# EAGLE design platine (EAGLE 6.5.0)
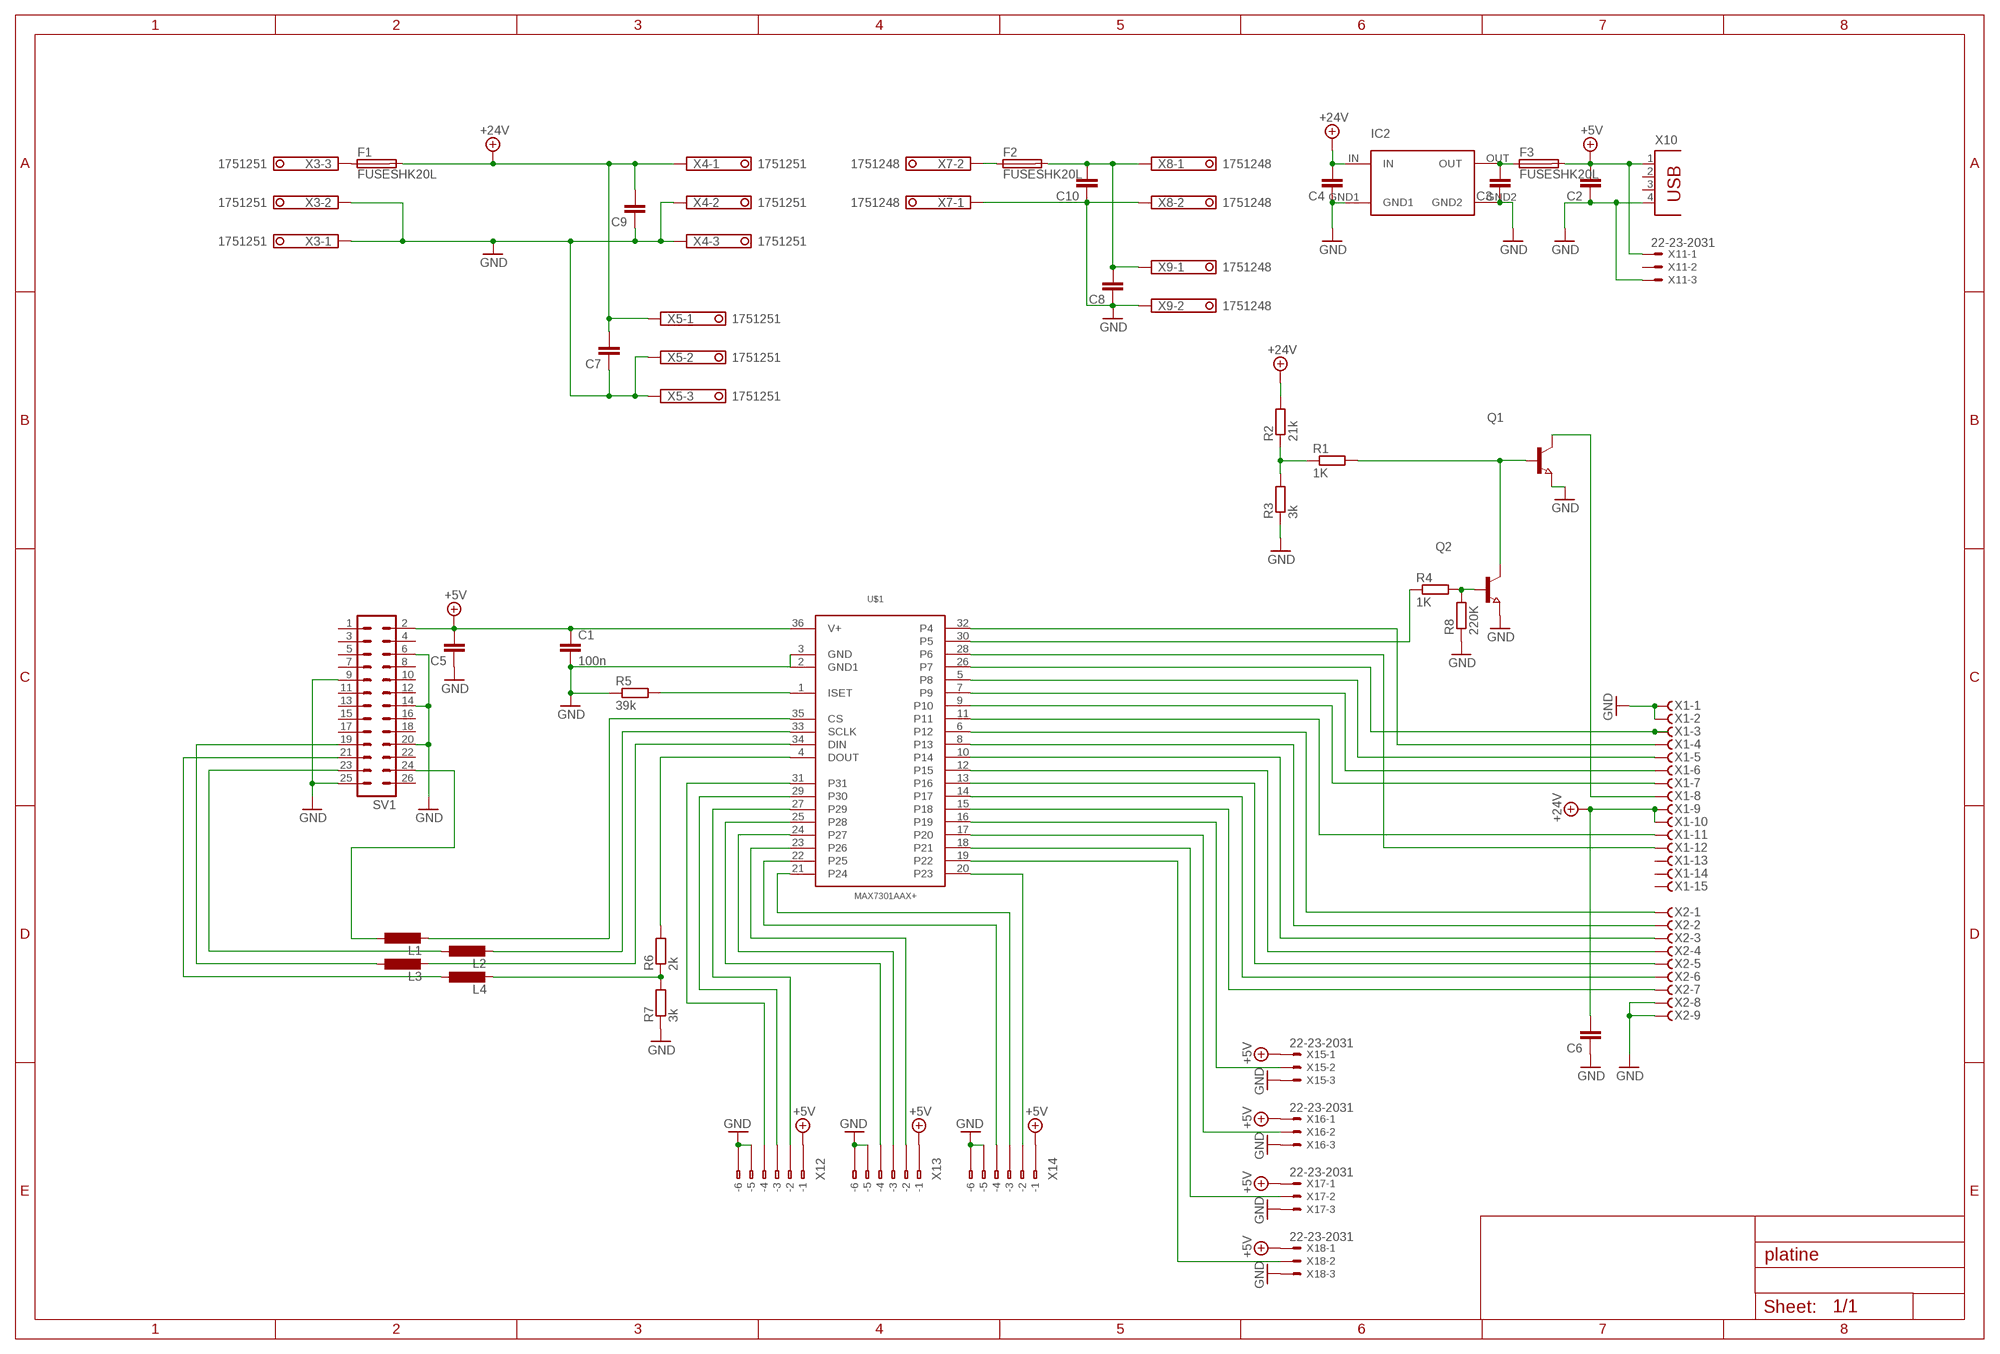
[diagram p0: schematic, sheet 1]

## Parts
C1  100n  C-EUC0603  [C0603]
C2  C-EUC1206  [C1206]
C3  C-EUC1206  [C1206]
C4  C-EUC1206  [C1206]
C5  C-EUC1206  [C1206]
C6  C-EUC1206  [C1206]
C7  C-EUC1206  [C1206]
C8  C-EUC1206  [C1206]
C9  C-EUC1206  [C1206]
C10  C-EUC1206  [C1206]
F1  FUSESHK20L  [SHK20L]
F2  FUSESHK20L  [SHK20L]
F3  FUSESHK20L  [SHK20L]
IC2  SPS-1  [SPS-1]
L1  L-EUL0402  [R0402]
L2  L-EUL0402  [R0402]
L3  L-EUL0402  [R0402]
L4  L-EUL0402  [R0402]
Q1  NPN-TRANSISTOR_SOT23  [SOT23]
Q2  NPN-TRANSISTOR_SOT23  [SOT23]
R1  1K  R-EU_R0603  [R0603]
R2  21k  R-EU_R0603  [R0603]
R3  3k  R-EU_R0603  [R0603]
R4  1K  R-EU_R0603  [R0603]
R5  39k  R-EU_R0603  [R0603]
R6  2k  R-EU_R0603  [R0603]
R7  3k  R-EU_R0603  [R0603]
R8  220K  R-EU_R0603  [R0603]
SV1  MA13-2  [MA13-2]
U$1  MAX7301AAX+  [SSOP36]
X1  F15HPS  [F15HP]
X2  F09HPS  [F09HP]
X3  1751251  [1751251]
X4  1751251  [1751251]
X5  1751251  [1751251]
X7  1751248  [1751248]
X8  1751248  [1751248]
X9  1751248  [1751248]
X10  PN87520  [PN87520]
X11  22-23-2031  [22-23-2031]
X12  233-506  [233-506]
X13  233-506  [233-506]
X14  233-506  [233-506]
X15  22-23-2031  [22-23-2031]
X16  22-23-2031  [22-23-2031]
X17  22-23-2031  [22-23-2031]
X18  22-23-2031  [22-23-2031]

## Nets
+5V: C1.1 C2.2 C5.2 F3.2A SV1.2 U$1.36(V+) X10.1 X11.1 X12.B1(B-1) X13.B1(B-1) X14.B1(B-1) X15.1 X16.1 X17.1 X18.1
+24V: C4.2 C6.2 C7.2 C9.2 F1.2A IC2.IN R2.2 X1.9 X1.10 X4.1 X5.1
GND: C1.2 C2.1 C3.1 C4.1 C5.1 C6.1 C7.1 C8.1 C9.1 C10.1 IC2.GND1 IC2.GND2 Q1.2(E) Q2.2(E) R3.1 R5.1 R7.1 R8.1 SV1.6 SV1.9 SV1.14 SV1.20 SV1.25 U$1.2(GND1) U$1.3(GND) X1.1 X1.2 X2.8 X2.9 X3.1 X3.2 X4.2 X4.3 X5.2 X5.3 X7.1 X8.2 X9.2 X10.4 X11.3 X12.B5(B-5) X12.B6(B-6) X13.B5(B-5) X13.B6(B-6) X14.B5(B-5) X14.B6(B-6) X15.3 X16.3 X17.3 X18.3
N$1: R1.1 R2.1 R3.2
N$2: Q1.1(B) Q2.3(C) R1.2
N$3: Q2.1(B) R4.2 R8.2
N$4: R4.1 U$1.30(P5)
N$5: L1.2 U$1.35(CS)
N$6: L4.1 SV1.21
N$7: Q1.3(C) X1.8
N$8: U$1.32(P4) X1.4
N$9: U$1.28(P6) X1.12
N$10: U$1.26(P7) X1.3
N$11: U$1.5(P8) X1.5
N$12: U$1.7(P9) X1.6
N$13: U$1.9(P10) X1.7
N$14: U$1.11 X1.11
N$15: U$1.6(P12) X2.1
N$16: U$1.8(P13) X2.2
N$17: U$1.10(P14) X2.3
N$18: U$1.12(P15) X2.4
N$19: U$1.13(P16) X2.5
N$20: U$1.14(P17) X2.6
N$21: U$1.15(P18) X2.7
N$22: L2.2 U$1.33(SCLK)
N$23: L3.2 U$1.34(DIN)
N$24: R6.2 U$1.4(DOUT)
N$26: U$1.16(P19) X15.2
N$27: R5.2 U$1.1(ISET)
N$28: U$1.17(P20) X16.2
N$29: U$1.18(P21) X17.2
N$30: U$1.19(P22) X18.2
N$31: U$1.20(P23) X14.B2(B-2)
N$32: U$1.21(P24) X14.B3(B-3)
N$33: U$1.22(P25) X14.B4(B-4)
N$34: U$1.23(P26) X13.B2(B-2)
N$35: U$1.24(P27) X13.B3(B-3)
N$36: U$1.25(P28) X13.B4(B-4)
N$37: U$1.27(P29) X12.B2(B-2)
N$38: U$1.29(P30) X12.B3(B-3)
N$39: U$1.31 X12.B4(B-4)
N$40: F1.1A X3.3
N$41: C3.2 F3.1A IC2.OUT
N$42: L1.1 SV1.24
N$43: F2.1A X7.2
N$44: C8.2 C10.2 F2.2A X8.1 X9.1
N$45: L2.1 SV1.23
N$46: L3.1 SV1.19
N$47: L4.2 R6.1 R7.2
Unconnected: SV1.1 SV1.3 SV1.4 SV1.5 SV1.7 SV1.8 SV1.10 SV1.11 SV1.12 SV1.13 SV1.15 SV1.16 SV1.17 SV1.18 SV1.22 SV1.26 X1.13 X1.14 X1.15 X10.2 X10.3 X11.2 X12.A1(-1) X12.A2(-2) X12.A3(-3) X12.A4(-4) X12.A5(-5) X12.A6(-6) X13.A1(-1) X13.A2(-2) X13.A3(-3) X13.A4(-4) X13.A5(-5) X13.A6(-6) X14.A1(-1) X14.A2(-2) X14.A3(-3) X14.A4(-4) X14.A5(-5) X14.A6(-6)

## Library data of the parts
C1-C10 = rcl:C-EU: CAPACITOR, European symbol
F1-F3 = fuse:FUSE: Fuse; OC_FARNELL: unknown; OC_NEWARK: unknown
IC2 = sps-1:SPS-1
L1-L4 = rcl:L-EU: INDUCTOR, European symbol
Q1 Q2 = semicon-smd-ipc:NPN-TRANSISTOR_: NPN TRANSISTOR
R1-R8 = rcl:R-EU_: RESISTOR, European symbol
SV1 = con-lstb:MA13-2: PIN HEADER; OC_FARNELL: unknown; OC_NEWARK: unknown
U$1 = maxim:MAX7301AAX+: Maxim 28 Port SPI 28 MHz I/O Expander 2.5 - 5.5 V
X1 = con-subd:F15?S: SUB-D; OC_FARNELL: unknown; OC_NEWARK: unknown
X2 = con-subd:F09?S: SUB-D; OC_FARNELL: unknown; OC_NEWARK: unknown
X3-X5 = con-phoenix-350:1751251: MKDS 1/ 3-3,5 Printklemme Nennstrom: 10 A Bemessungsspannung: 160 V Raster: 3,5 mm Polzahl: 3 Montageart: Löten Anschlussart: Schraubanschluss Anschlussrichtung vom Leiter zur Platine: 0° Source: http://eshop.phoenixcontact.com .. 1751251.pdf; OC_FARNELL: unknown; OC_NEWARK: unknown
X7-X9 = con-phoenix-350:1751248: MKDS 1/ 2-3,5 Printklemme Nennstrom: 10 A Bemessungsspannung: 160 V Raster: 3,5 mm Polzahl: 2 Montageart: Löten Anschlussart: Schraubanschluss Anschlussrichtung vom Leiter zur Platine: 0° Source: http://eshop.phoenixcontact.com .. 1751248.pdf; OC_FARNELL: unknown; OC_NEWARK: unknown
X10 = con-berg:PN87520: BERG USB connector; OC_FARNELL: unknown; OC_NEWARK: unknown
X11 X15-X18 = con-molex:22-23-2031: .100" (2.54mm) Center Header - 3 Pin; MF: MOLEX; MPN: 22-23-2031; OC_FARNELL: 1462950; OC_NEWARK: 30C0862
X12-X14 = con-wago:233-506: WAGO Cage Clamp; MF: Wago Corporation; MPN: 0233-0506; OC_FARNELL: 1777100; OC_NEWARK: 79K2052

## Board
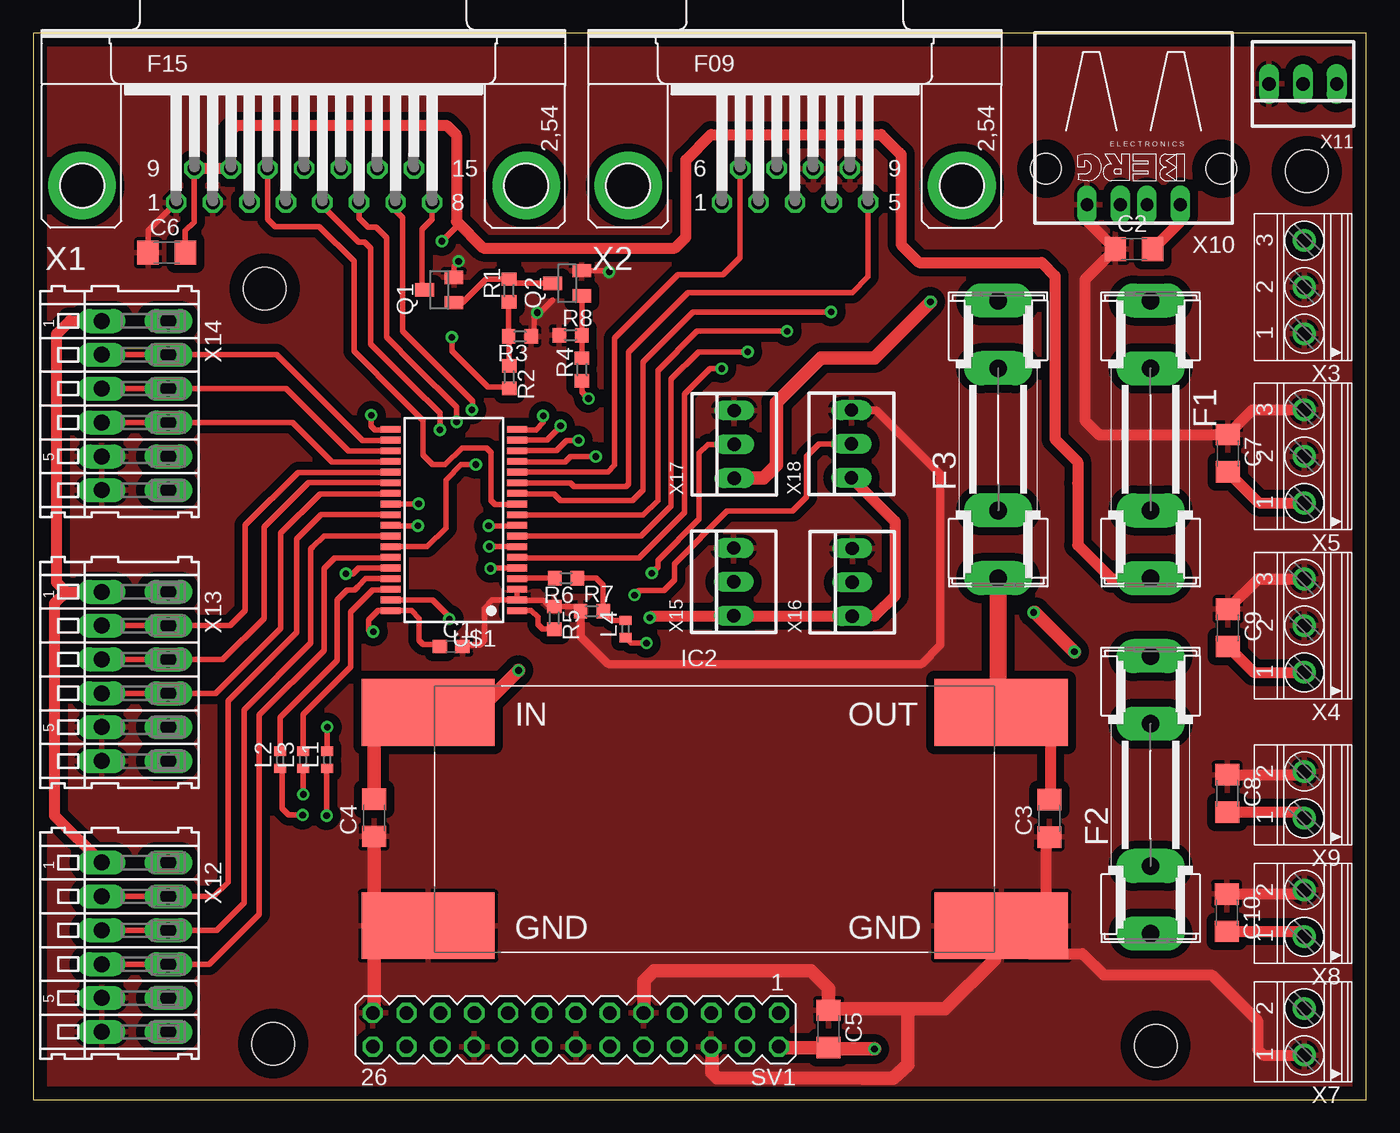
[diagram p1: board, top side]
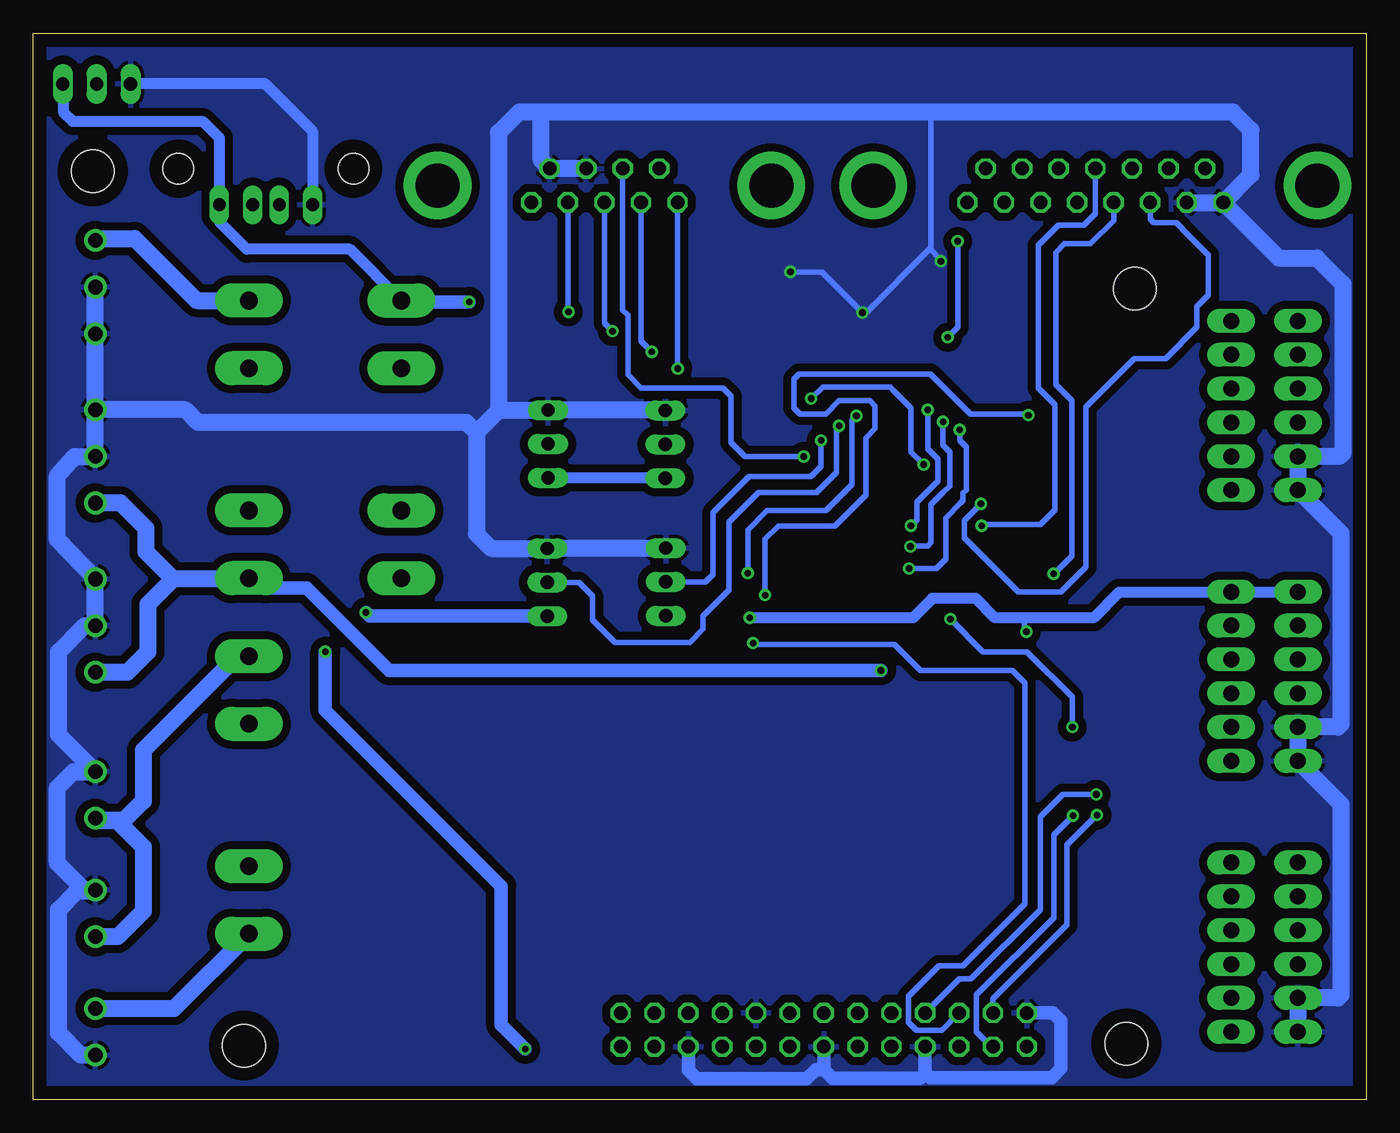
[diagram p2: board, bottom side, seen from below]

Size 100 x 80 mm. Coordinates in mm from the lower left corner, seen from the top.
Outline: 0,0 100,0 100,80 0,80 0,0
Copper layers (1*16): Top 0.035mm / dielectric 1.5mm / Bottom 0.035mm
Design rules "default": minimum track width 10mil, minimum drill 24mil, track to track 8mil, track to pad 8mil, pad to pad 8mil, via to via 8mil, smd to smd 8mil, copper to edge 40mil, drill to drill 8mil, minimum pad ring 10mil, minimum via ring 8mil, stop-mask expansion 4mil, vias tented up to drill 0mil, thermal gap 10mil
Holes 3.2 mm at 84.2,4.05 18,4.2 95.55,69.65 17.35,60.85

### Footprints (pad centres in the part's own frame; a part is rotated, then mirrored left to right if it is on the bottom)
C0603 = smd 1.1 x 1: 1 -0.85,0; 2 0.85,0
C1206 = smd 1.6 x 1.8: 1 -1.4,0; 2 1.4,0
SHK20L = drill 1.321 pad 2.54 long: 1A -10.414,0; 1B -5.334,0; 2A 10.414,0; 2B 5.334,0
SPS-1 = smd 10 x 5: GND1 -21.5,-8; GND2 21.5,-8; IN -21.5,8; OUT 21.5,8
R0402 = smd 0.7 x 0.9: 1 -0.65,0; 2 0.65,0
SOT23 = smd 1 x 1.4: 1 -0.95,-1.1; 2 0.95,-1.1; 3 0,1.1
R0603 = smd 1 x 1.1: 1 -0.85,0; 2 0.85,0
MA13-2 = drill 1.016 octagon: 1 -15.24,-1.27; 2 -15.24,1.27; 3 -12.7,-1.27; 4 -12.7,1.27; 5 -10.16,-1.27; 6 -10.16,1.27; 7 -7.62,-1.27; 8 -7.62,1.27; 9 -5.08,-1.27; 10 -5.08,1.27; 11 -2.54,-1.27; 12 -2.54,1.27; 13 0,-1.27; 14 0,1.27; 15 2.54,-1.27; 16 2.54,1.27; 17 5.08,-1.27; 18 5.08,1.27; 19 7.62,-1.27; 20 7.62,1.27; 21 10.16,-1.27; 22 10.16,1.27; 23 12.7,-1.27; 24 12.7,1.27; 25 15.24,-1.27; 26 15.24,1.27
SSOP36 = smd 0.5 x 1.5: 1 -6.8,-4.75; 2 -6,-4.75; 3 -5.2,-4.75; 4 -4.4,-4.75; 5 -3.6,-4.75; 6 -2.8,-4.75; 7 -2,-4.75; 8 -1.2,-4.75; 9 -0.4,-4.75; 10 0.4,-4.75; 11 1.2,-4.75; 12 2,-4.75; 13 2.8,-4.75; 14 3.6,-4.75; 15 4.4,-4.75; 16 5.2,-4.75; 17 6,-4.75; 18 6.8,-4.75; 19 6.8,4.75; 20 6,4.75; 21 5.2,4.75; 22 4.4,4.75; 23 3.6,4.75; 24 2.8,4.75; 25 2,4.75; 26 1.2,4.75; 27 0.4,4.75; 28 -0.4,4.75; 29 -1.2,4.75; 30 -2,4.75; 31 -2.8,4.75; 32 -3.6,4.75; 33 -4.4,4.75; 34 -5.2,4.75; 35 -6,4.75; 36 -6.8,4.75
F15HP = drill 1.016 octagon: 1 -9.601,-1.27; 2 -6.858,-1.27; 3 -4.115,-1.27; 4 -1.372,-1.27; 5 1.372,-1.27; 6 4.115,-1.27; 7 6.858,-1.27; 8 9.601,-1.27; 9 -8.23,1.27; 10 -5.486,1.27; 11 -2.743,1.27; 12 0,1.27; 13 2.743,1.27; 14 5.486,1.27; 15 8.23,1.27 | drill 3.302 pad 5.08: G1 -16.662,0; G2 16.662,0
F09HP = drill 1.016 octagon: 1 -5.486,-1.27; 2 -2.743,-1.27; 3 0,-1.27; 4 2.743,-1.27; 5 5.486,-1.27; 6 -4.115,1.27; 7 -1.372,1.27; 8 1.372,1.27; 9 4.115,1.27 | drill 3.302 pad 5.08: G1 -12.522,0; G2 12.522,0
1751251 = drill 1.1 pad 1.7: 1 -3.5,-0.1; 2 0,-0.1; 3 3.5,-0.1
1751248 = drill 1.1 pad 1.7: 1 -1.75,-0.1; 2 1.75,-0.1
PN87520 = drill 0.95 long: 1 -3.5,2.71; 2 -1,2.71; 3 1,2.71; 4 3.5,2.71 | hole 2.3: -6.57,0; 6.57,0
22-23-2031 = drill 1 long: 1 -2.54,0; 2 0,0; 3 2.54,0
233-506 = drill 1.2 long: A1 -6.35,2.5; A2 -3.81,2.5; A3 -1.27,2.5; A4 1.27,2.5; A5 3.81,2.5; A6 6.35,2.5; B1 -6.35,-2.5; B2 -3.81,-2.5; B3 -1.27,-2.5; B4 1.27,-2.5; B5 3.81,-2.5; B6 6.35,-2.5

### Placement (x,y rotation side)
C1  31.34,33.99 0 top
C2  82.58,63.8 0 top
C3  76.23,21.09 90 top
C4  25.56,21.14 90 top
C5  59.66,5.3 270 top
C6  10.01,63.53 0 top
C7  89.62,48.49 270 top
C8  89.57,22.97 270 top
C9  89.62,35.39 270 top
C10  89.53,14.02 270 top
F1  83.82,49.53 270 top
F2  83.82,22.86 90 top
F3  72.39,49.53 90 top
IC2  51.12,21.04 0 top
L1  22.06,25.49 90 top
L2  18.52,25.49 90 top
L3  20.23,25.49 90 top
L4  44.44,35.29 90 top
Q1  30.45,60.75 90 top
Q2  40.05,61.25 90 top
R1  35.69,60.71 90 top
R2  35.71,54.21 270 top
R3  36.51,57.26 180 top
R4  41.16,54.78 90 top
R5  39.08,36.14 270 top
R6  39.97,39.12 180 top
R7  41.9,36.65 0 top
R8  40.3,57.35 0 top
SV1  40.7,5.23 180 top
U$1  31.56,43.48 90 top
X1  20.32,68.58 0 top
X2  57.15,68.58 0 top
X3  95.25,60.96 90 top
X4  95.25,35.56 90 top
X5  95.25,48.26 90 top
X7  95.25,5.08 90 top
X8  95.25,13.97 90 top
X9  95.25,22.86 90 top
X10  82.55,69.85 180 top
X11  95.25,76.2 180 top
X12  7.62,11.43 270 top
X13  7.62,31.75 270 top
X14  7.62,52.07 270 top
X15  52.54,38.84 90 top
X16  61.44,38.81 90 top
X17  52.58,49.16 90 top
X18  61.38,49.19 90 top

### Tracks (layer width: path | path; a pad name or v marks a point on that pad's centre or on a via)
+5V  (via drill 0.5)
  Top 0.406: C1.1 30.33,34.15 29.25,34.15 28.95,34.45 28.95,36.1 28.37,36.68 U$1.36 26.79,36.7 25.85,36.7 25.15,36 25.15,35.25 25.3,35.1 v25.5,35.1
  Top 0.813: X18.1 64.65,43.38 64.65,37.8 63.12,36.27 X16.1 53.55,36.27 | X15.1 52.57,36.27 53.55,36.27 | v46.25,36.15 46.37,36.27 53.55,36.27 | X12.B1 1.6,21.3 1.6,37.25 2.45,38.1 X13.B1 5.07,38.05 2.5,38.05 1.75,38.8 1.75,57.45 2.72,58.42 X14.B1 | C2.2 86.05,65.87 X10.1
  Top 1.016: 56,3.9 SV1.2 56,3.9 | 56,3.9 C5.2 | 56,3.9 60,3.9 60.1,3.8 v63.1,3.8 | v78.1,33.6 75.15,36.55 v75.05,36.55 | v67.3,59.85 63.1,55.65 59.1,55.65 55.75,52.3 55.75,47.6 54.77,46.62 X17.1
  Bottom 0.406: v25.5,35.1 25.65,35.25 25.65,36.15
  Bottom 0.813: X17.1 52.61,46.65 X18.1 | X13.B1 5.17,38.05 14.1,38.05 18.55,38.05 20.45,36.15 24.7,36.15 25.15,36.15 25.65,36.15 27.85,36.15 29.3,37.6 32.55,37.6 34,36.15 v46.25,36.15 | X11.1 97.75,76.16 97.75,74.1 97.05,73.4 87.3,73.4 86.05,72.15 X10.1 86.05,65.87 C2.2 76.25,63.8 F3.2A
  Bottom 1.016: v63.1,3.8 64.9,5.6 64.9,16 78.1,29.2 v78.1,33.6 | v75.05,36.55 74.77,36.27 X16.1 | F3.2A 72.3,59.85 v67.3,59.85
+24V  (via drill 0.5)
  Top 0.406: C6.2 11.41,65.21 12.05,65.85 12.05,69.81 X1.9 | R2.2 35.62,53.45 34.1,53.45 31.4,56.15 v31.4,57.2 | v30.65,64.4 31.75,65.5 31.75,65.9
  Top 0.813: C9.2 91.55,32.06 X4.1 | C7.2 91.95,44.76 X5.1 | F1.2A 83.75,39.05 80.9,39.05 78.35,41.6 78.35,46.25 78.35,47.85 76.65,49.55 76.65,61.8 75.65,62.8 66.45,62.8 65.1,64.15 65.1,70.9 64.95,71.05 63.6,72.4 50.85,72.4 48.95,70.5 48.95,64.7 48.15,63.9 33.75,63.9 31.75,65.9 31.75,72.35 31,73.1 15.25,73.1 14.83,72.68 X1.10 X1.9
  Top 1.016: v36.4,32.2 33.24,29.04 IC2.IN 29.18,28.6 26,28.6 25.56,28.16 C4.2
  Bottom 0.406: v31.4,57.2 30.65,57.95 v30.65,64.4
  Bottom 1.016: v36.4,32.2 73.3,32.2 79.5,38.4 83.1,38.4 F1.2A
  Bottom 1.27: F1.2A 83.89,39.05 89.5,39.05 | 89.5,39.05 91.4,37.15 91.4,33.6 92.94,32.06 X4.1 | 89.5,39.05 91.55,41.1 91.55,42.85 93.46,44.76 X5.1
GND  (via drill 0.5)
  Top 0.406: R3.1 37.55,57.45 37.55,58.6 | 37.55,58.6 38.95,60 | U$1.2 36.34,37.45 38.3,37.45 38.76,36.99 R5.1 40.71,36.99 R7.1 | U$1.3 U$1.2 | C1.2 32.3,34.1 33.5,34.1 33.85,34.45 33.85,36.9 34.43,37.48 U$1.2 | C6.1 8.61,65.2 X1.1 | 39.21,57.59 R8.1 | 37.55,58.6 37.55,58.8 v37.8,59.05 | 40.75,62.2 Q2.2 43.1,62.2 v43.2,62.1 | Q1.2 31.55,62.55 v31.9,62.9
  Top 0.61: R7.1 41.05,34.75 43.1,32.7 66.65,32.7 68.05,34.1 68.05,46.9 63.25,51.7 61.9,51.7 61.87,51.73 X18.3
  Top 0.813: X10.4 79.05,65.93 C2.1 78.9,61.52 78.9,50.95 79.96,49.89 C7.1 91.49,51.76 X5.3 | C9.1 91.89,39.06 X4.3 | C10.1 95.35,15.42 X8.2 | C8.1 95.35,24.37 X9.2 | C3.1 75.95,19.41 75.95,13.1 75.7,12.85 72.1,12.85 72.29,13.04 IC2.GND2 | 73.3,12.36 74.71,10.95 78.7,10.95 80.3,9.35 88.4,9.35 91.85,5.9 91.85,3.75 92.27,3.33 X7.1
  Top 1.016: C4.1 25.56,13.44 26,13 | 26,13 29.58,13 IC2.GND1 | SV1.25 25.55,6.59 25.55,12.25 26,12.7 26,13 | 65.6,6.8 59.76,6.8 C5.1 59.66,8.34 58.35,9.65 46.55,9.65 45.8,8.9 45.8,6.52 SV1.9 | 65.6,6.8 68.4,6.8 72.1,10.5 72.1,12.85 | SV1.6 50.9,3.92 50.9,2 51.3,1.65 62.25,1.6 64.5,1.6 65.6,2.6 65.6,6.8
  Top 1.27: IC2.GND2 73.3,12.36
  Bottom 0.406: 32.73,63.83 37.5,59.05 v37.8,59.05 40.85,62.1 v43.2,62.1 | 32.73,63.83 32.65,63.9 32.65,74.05 32.6,74.1 | v31.9,62.9 31.9,63 32.73,63.83
  Bottom 0.813: X11.3 92.66,76.25 82.65,76.25 79.05,72.65 X10.4
  Bottom 1.016: 33.1,2.05 33.1,1.95 33.45,1.6 40.05,1.6 40.7,2.25 | 40.7,2.25 SV1.14 | SV1.20 33.1,3.94 33.1,2.05 | 33.1,2.05 32.7,1.65 23.6,1.65 22.9,2.35 22.9,5.9 23.5,6.5 SV1.25 | SV1.6 50.85,2.2 50.2,1.55 42,1.55 41.3,2.25 40.7,2.25
  Bottom 1.27: X5.3 X5.2 96.89,48.26 98.2,46.8 98.2,42.01 X4.3 X4.2 96.14,35.56 98.1,33.6 98.1,27.36 X9.2 97,24.6 98.2,23.4 98.2,17.75 96.17,15.72 X8.2 95.42,15.65 96.7,15.65 98.1,14.25 98.1,5 96.43,3.33 X7.1 | X5.3 X3.1 X3.2 | X17.3 52.61,51.73 X18.3 61.41,51.7 65.1,51.7 | 65.1,51.7 66.75,50.05 | 66.75,50.05 66.75,42.45 65.65,41.35 X16.3 52.57,41.35 X15.3 | 66.75,50.05 67.5,50.8 87.65,50.8 88.61,51.76 X5.3 | X1.1 6.56,63.15 3.7,63.15 1.75,61.2 1.75,48.5 1.99,48.26 X14.B5 X14.B6 1.9,42.5 1.9,28.15 2.11,27.94 X13.B5 X13.B6 1.9,22.18 1.9,7.85 2.13,7.62 X12.B5 X12.B6 | X1.1 8.65,69.38 8.65,72.75 10,74.1 32.6,74.1 61.9,74.1 | 61.9,74.1 63.55,74.1 65.1,72.55 65.1,51.7 | X1.2 X1.1 | X2.8 X2.9 61.9,70.48 61.9,74.1
  pour Bottom (isolate 0.61): 0.1,80.05 100,80.05 100,-0.05 0.1,-0.05
  pour Top (isolate 0.61): 0.05,79.95 99.95,79.95 99.95,0.1 0.05,0.1
N$1
  Top 0.406: R1.1 35.66,59.83 R3.2 35.71,57.21 R2.1
N$2
  Top 0.406: R1.2 33.95,61.56 32.19,59.8 Q1.1 | R1.2 35.76,61.63 | Q2.3 36,61.25 R1.2
N$3
  Top 0.406: R4.2 R8.2 Q2.1
N$4  (via drill 0.5)
  Top 0.406: U$1.30 26.83,41.5 29.55,41.5 30.95,42.9 30.95,46.5 32.1,47.65 v33.2,47.65 | v41.65,52.6 41.16,53.09 R4.1
  Bottom 0.406: v33.2,47.65 34.15,48.6 34.15,51.9 35.5,53.25 35.7,53.45 40.2,53.45 40.75,53.45 v41.65,52.6
N$5  (via drill 0.5)
  Top 0.406: U$1.35 26.83,37.5 28.85,37.5 29.95,37.5 31.2,36.25 v31.2,36.05 | v22.05,27.95 v22.06,27.94 L1.2
  Bottom 0.406: v31.2,36.05 28.75,33.6 25.45,33.6 22.05,30.2 v22.05,27.95
N$6  (via drill 0.5)
  Top 0.406: L4.1 44.83,34.25 v46,34.25
  Bottom 0.406: v46,34.25 45.9,34.15 35.4,34.15 33.45,32.2 26.55,32.2 25.6,31.25 25.6,14.7 30.25,10.05 32.05,10.05 34.35,7.75 34.35,5.8 33.75,5.2 31.84,5.2 SV1.21
N$7
  Top 0.406: X1.8 29.92,66.07 29.15,65.3 29.15,60.86 29.26,60.75 Q1.3
N$8  (via drill 0.5)
  Top 0.406: U$1.32 26.79,39.9 25.3,39.9 24.4,39.9 23.95,39.45 v23.45,39.45
  Bottom 0.406: X1.4 18.95,65.95 20.7,64.2 22.65,64.2 23.3,63.55 23.3,53.65 22.1,52.45 22.1,40.8 v23.45,39.45
N$9  (via drill 0.5)
  Top 0.406: U$1.28 26.84,43.05 v28.85,43.05
  Bottom 0.406: 28.8,43 v28.85,43.05 28.75,43.15 24.45,43.15 23.35,44.25 23.35,52.15 24.6,53.4 24.6,64.1 23.1,65.6 21.2,65.6 20.32,66.48 X1.12
N$10  (via drill 0.5)
  Top 0.406: U$1.26 26.83,44.7 v28.9,44.7
  Bottom 0.406: v28.9,44.7 30.15,43.45 30.15,42.15 26.1,38.1 22.9,38.1 21.05,39.95 21.05,51.95 17.4,55.6 15.05,55.6 12.7,57.95 12.7,59.5 11.85,60.35 11.85,63.35 13.8,65.3 13.8,65.35 14.25,65.8 15.95,65.8 16.2,66.06 X1.3
N$11  (via drill 0.5)
  Top 0.406: X1.5 21.75,67.25 21.75,67 24,64.75 24.4,64.35 24.85,64.35 25.3,63.9 25.3,56.7 28.38,53.62 | 28,54 28.38,53.62 | 28.38,53.62 30.5,51.5 v30.5,50.25 | v34.3,39.85 34.33,39.88 U$1.5
  Bottom 0.406: v34.3,39.85 32.25,39.85 31.55,40.55 31.55,43.65 30.45,44.75 30.25,44.95 30.25,45.5 30,45.75 30,48.95 30.5,49.45 v30.5,50.25
N$12  (via drill 0.5)
  Top 0.406: U$1.7 36.29,41.5 v34.2,41.5 | v31.75,50.85 31.75,51.95 28.65,55.05 26.5,57.2 26.5,64.65 25.7,65.45 25.1,65.45 24.43,66.11 24.43,66.23 X1.6
  Bottom 0.406: v34.2,41.5 34.15,41.55 32.9,41.55 32.65,41.8 32.65,44.65 31.75,45.55 31.25,46.05 31.25,48.6 31.75,49.1 v31.75,50.85
N$13  (via drill 0.5)
  Top 0.406: U$1.9 36.28,43.05 v34.15,43.05 | v32.9,51.75 32.95,52.05 32.95,52.4 28.9,56.45 27.7,57.65 27.7,58.2 27.7,66.16 27.18,66.68 X1.7
  Bottom 0.406: v34.15,43.05 33.7,43.5 33.7,44.85 32.9,45.65 32.15,46.4 32.15,48.05 32.9,48.8 v32.9,51.75
N$14
  Top 0.406: U$1.11 36.28,44.65 34.65,44.65 34.35,44.95 34.35,48.55 34,48.9 32.15,48.9 30.9,47.65 29.95,47.65 29.25,48.35 29.25,50.95 27.55,52.65 | 27.55,52.65 27.35,52.85 | X1.11 17.58,66.07 18.15,65.5 21.45,65.5 24.05,62.9 24.05,56.15 27.55,52.65
N$15  (via drill 0.5)
  Top 0.406: U$1.6 36.34,40.65 40.55,40.65 45.45,40.65 48.85,44.05 48.85,52.95 50.75,54.85 v51.65,54.85
  Bottom 0.406: v51.65,54.85 51.66,54.86 X2.1
N$16  (via drill 0.5)
  Top 0.406: U$1.8 36.33,42.3 44.65,42.3 45.6,42.3 47.85,44.55 47.85,54.05 49.9,56.1 v53.6,56.1
  Bottom 0.406: v53.6,56.1 54.41,56.91 X2.2
N$17  (via drill 0.5)
  Top 0.406: U$1.10 36.34,43.85 45.3,43.85 45.75,43.85 46.85,44.95 46.85,54.7 49.8,57.65 v56.55,57.65
  Bottom 0.406: v56.55,57.65 57.15,58.25 X2.3
N$18  (via drill 0.5)
  Top 0.406: U$1.12 36.34,45.45 39.05,45.45 39.55,44.95 44.95,44.95 45.75,45.75 45.75,55.35 49.5,59.1 v59.85,59.1
  Bottom 0.406: v59.85,59.1 59.89,59.14 X2.4
N$19
  Top 0.406: U$1.13 36.34,46.25 40.3,46.25 40.55,46 44,46 44.45,46 44.65,46.2 44.65,56.1 49.1,60.55 61.45,60.55 62.64,61.74 X2.5
N$20
  Top 0.406: U$1.14 36.33,47.1 41.6,47.1 43.1,47.1 43.6,47.6 43.6,55.6 43.6,57.15 48.35,61.9 51.75,61.9 53.03,63.19 X2.6
N$21  (via drill 0.5)
  Top 0.406: U$1.15 36.34,47.85 39.9,47.85 40.3,48.25 v42.2,48.25
  Bottom 0.406: v42.2,48.25 46.6,48.25 47.65,49.3 47.65,52.8 48.25,53.4 54.4,53.4 55.4,54.4 55.4,58.85 55.78,59.23 X2.7
N$22
  Top 0.406: U$1.33 24.93,39.08 24.35,38.5 24.1,38.25 23.55,38.25 23.05,37.75 22.8,37.5 22.8,32.95 19.75,29.9 18.52,28.67 L2.2
N$23
  Top 0.406: U$1.34 26.78,38.25 25.45,38.25 24.4,37.2 23.8,36.6 23.8,32.45 22.03,30.68 20.23,28.88 L3.2
N$24
  Top 0.406: U$1.4 36.35,39.12 R6.2
N$26  (via drill 0.5)
  Top 0.406: U$1.16 36.33,48.7 39.25,48.7 40,49.45 v40.9,49.45
  Bottom 0.406: v40.9,49.45 40.9,47.5 41.65,46.75 46.3,46.75 49,44.05 49,39.4 49.56,38.84 X15.2
N$27
  Top 0.406: U$1.1 36.33,36.7 37.35,36.7 37.85,36.2 37.85,35.65 38.21,35.29 R5.2
N$28  (via drill 0.5)
  Top 0.406: U$1.17 36.33,49.5 38.55,49.5 39.55,50.5 v39.55,50.55
  Bottom 0.406: v39.55,50.55 39.75,50.35 39.75,47.05 41.25,45.55 45.6,45.55 47.8,43.35 47.8,38.25 49.75,36.3 49.75,35.3 50.75,34.3 56.35,34.3 58.05,36 58.05,37.8 59.06,38.81 X16.2
N$29  (via drill 0.5)
  Top 0.406: U$1.18 36.34,50.25 37.7,50.25 38.25,50.8 v38.25,51.3 | v46.4,39.5 46.85,39.95 46.85,40.1 46.85,40.45 49.95,43.55 49.95,48.5 50.61,49.16 X17.2
  Bottom 0.406: v38.25,51.3 38.6,50.95 38.6,46.15 40.55,44.2 44.95,44.2 46.4,42.75 v46.4,39.5
N$30  (via drill 0.5)
  Top 0.406: U$1.19 26.78,50.25 25.65,50.25 25.35,50.55 v25.35,51.35 | v45.1,37.85 45.45,38.2 47.3,38.2 48.1,39 48.1,39.85 48.1,40.2 52.05,44.15 56.95,44.15 58,45.2 58,48.25 58.94,49.19 X18.2
  Bottom 0.406: v25.35,51.35 25.45,51.45 28.95,51.45 29.7,51.45 32.7,54.45 42.55,54.45 42.95,54.05 42.95,51.9 42.5,51.45 40.55,51.45 39.55,52.45 37.25,52.45 36.85,52.05 36.85,50.35 37.55,49.65 37.55,45.35 39.85,43.05 44.1,43.05 45.1,42.05 v45.1,37.85
N$31
  Top 0.406: U$1.20 26.78,49.45 24.7,49.45 18.27,55.88 X14.B2
N$32
  Top 0.406: U$1.21 26.78,48.65 23.65,48.65 18.96,53.34 X14.B3
N$33
  Top 0.406: U$1.22 26.78,47.85 22.4,47.85 19.45,50.8 X14.B4
N$34
  Top 0.406: U$1.23 26.78,47.05 19.85,47.05 15.9,43.1 15.9,36.7 14.76,35.56 X13.B2
N$35
  Top 0.406: U$1.24 26.79,46.3 20.65,46.3 17.3,42.95 17.3,36.1 14.22,33.02 X13.B3
N$36
  Top 0.406: U$1.25 26.78,45.45 21.5,45.45 18.55,42.5 18.55,35.35 13.68,30.48 X13.B4
N$37
  Top 0.406: U$1.27 26.79,43.9 21.6,43.9 19.75,42.05 19.75,35.05 19.45,34.75 14.6,29.9 14.6,28.9 14.6,24.35 14.6,16.3 13.54,15.24 X12.B2
N$38
  Top 0.406: U$1.29 26.79,42.3 21.8,42.3 20.95,41.45 20.8,41.3 20.8,34.25 15.8,29.25 15.8,28.05 15.8,14.75 13.75,12.7 X12.B3
N$39
  Top 0.406: U$1.31 26.78,40.65 22.6,40.65 22.1,40.15 21.8,39.85 21.8,33.7 16.95,28.85 16.95,26.9 16.95,13.9 13.21,10.16 X12.B4
N$40
  Bottom 1.27: X3.3 95.21,64.6 92.4,64.6 87.74,59.94 F1.1A
N$41
  Top 0.813: C3.2 76.35,22.61 76.35,29.15 76.24,29.04 IC2.OUT
  Top 1.27: IC2.OUT 72.39,29.27 F3.1A
N$42  (via drill 0.5)
  Top 0.406: L1.1 22,24.78 v22,21.3
  Bottom 0.406: v22,21.3 23.45,19.85 23.45,13.65 29.25,7.85 29.25,5.1 28.11,3.96 SV1.24
N$43
  Bottom 1.27: X7.2 89.44,6.83 F2.1A
N$44
  Top 0.813: C10.2 95.35,12.62 X8.1 | C8.2 95.35,21.57 X9.1
  Bottom 1.27: F2.2A 84.68,33.27 89.25,28.7 91.75,26.2 91.75,22.4 93.2,20.95 95.19,20.95 | 95.19,20.95 X9.1 | 95.19,20.95 93.75,20.95 91.75,18.95 91.75,14.15 91.85,14.05 93.68,12.22 X8.1
N$45  (via drill 0.5)
  Top 0.406: L2.1 18.65,24.71 18.65,21.85 19.15,21.35 v20.2,21.35
  Bottom 0.406: v20.2,21.35 22.45,19.1 22.45,13.1 28,7.55 SV1.23
N$46  (via drill 0.5)
  Top 0.406: v20.25,22.9 20.23,22.92 L3.1
  Bottom 0.406: v20.25,22.9 22.75,22.9 24.45,21.2 24.45,14.25 29.65,9.05 30.53,9.05 SV1.19
N$47
  Top 0.406: R6.1 40.85,39.15 42.2,39.15 42.75,38.6 R7.2 43.46,35.94 L4.2